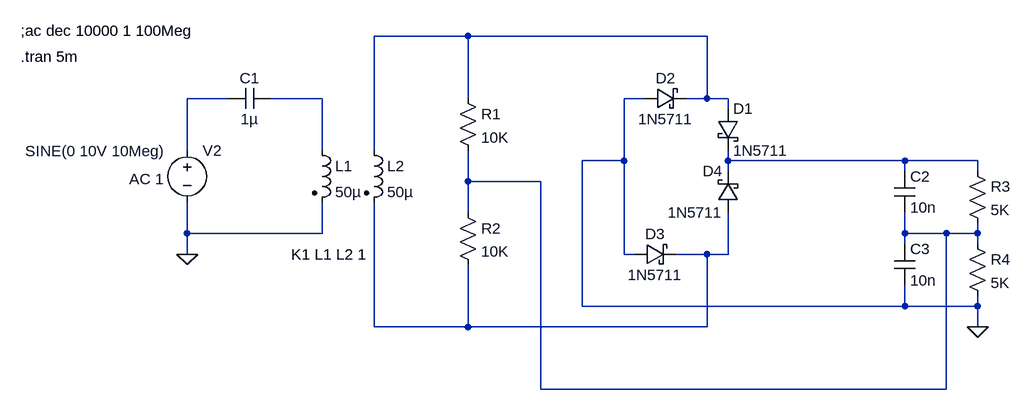
[diagram p0: schematic RF Rectifier Test.asc]
RF Rectifier Test.asc, the LTspice schematic file:
Version 4
SHEET 1 1576 708
WIRE 704 -64 560 -64
WIRE 1072 -64 704 -64
WIRE 336 32 272 32
WIRE 480 32 400 32
WIRE 704 32 704 -64
WIRE 976 32 944 32
WIRE 1072 32 1072 -64
WIRE 1072 32 1040 32
WIRE 1104 32 1072 32
WIRE 1104 48 1104 32
WIRE 272 112 272 32
WIRE 480 112 480 32
WIRE 560 112 560 -64
WIRE 944 128 944 32
WIRE 944 128 880 128
WIRE 1104 128 1104 112
WIRE 1376 128 1104 128
WIRE 1488 128 1376 128
WIRE 1104 144 1104 128
WIRE 1376 144 1376 128
WIRE 1488 144 1488 128
WIRE 704 160 704 112
WIRE 816 160 704 160
WIRE 704 208 704 160
WIRE 272 240 272 192
WIRE 480 240 480 192
WIRE 480 240 272 240
WIRE 1376 240 1376 208
WIRE 1440 240 1376 240
WIRE 1488 240 1488 224
WIRE 1488 240 1440 240
WIRE 1376 256 1376 240
WIRE 1488 256 1488 240
WIRE 272 272 272 240
WIRE 944 272 944 128
WIRE 960 272 944 272
WIRE 1072 272 1024 272
WIRE 1104 272 1104 208
WIRE 1104 272 1072 272
WIRE 880 352 880 128
WIRE 1376 352 1376 320
WIRE 1376 352 880 352
WIRE 1488 352 1488 336
WIRE 1488 352 1376 352
WIRE 560 384 560 192
WIRE 704 384 704 288
WIRE 704 384 560 384
WIRE 1072 384 1072 272
WIRE 1072 384 704 384
WIRE 1488 384 1488 352
WIRE 816 480 816 160
WIRE 1440 480 1440 240
WIRE 1440 480 816 480
FLAG 272 272 0
FLAG 1488 384 0
SYMBOL voltage 272 96 R0
WINDOW 123 -89 60 Left 2
WINDOW 39 0 0 Left 2
WINDOW 3 -249 17 Left 2
SYMATTR Value2 AC 1
SYMATTR InstName V2
SYMATTR Value SINE(0 10V 10Meg)
SYMBOL schottky 976 48 R270
WINDOW 0 32 32 VTop 2
WINDOW 3 0 32 VBottom 2
SYMATTR InstName D2
SYMATTR Value 1N5711
SYMATTR Description Diode
SYMATTR Type diode
SYMBOL cap 1360 144 R0
SYMATTR InstName C2
SYMATTR Value 10n
SYMBOL schottky 1088 48 R0
SYMATTR InstName D1
SYMATTR Value 1N5711
SYMATTR Description Diode
SYMATTR Type diode
SYMBOL schottky 960 288 R270
WINDOW 0 32 32 VTop 2
WINDOW 3 0 32 VBottom 2
SYMATTR InstName D3
SYMATTR Value 1N5711
SYMATTR Description Diode
SYMATTR Type diode
SYMBOL schottky 1120 208 R180
WINDOW 0 24 64 Left 2
WINDOW 3 24 0 Left 2
SYMATTR InstName D4
SYMATTR Value 1N5711
SYMATTR Description Diode
SYMATTR Type diode
SYMBOL ind2 464 96 R0
SYMATTR InstName L1
SYMATTR Value 50µ
SYMATTR Type ind
SYMBOL ind2 544 96 R0
SYMATTR InstName L2
SYMATTR Value 50µ
SYMATTR Type ind
SYMBOL cap 400 16 R90
WINDOW 0 0 32 VBottom 2
WINDOW 3 32 32 VTop 2
SYMATTR InstName C1
SYMATTR Value 1µ
SYMBOL res 688 16 R0
SYMATTR InstName R1
SYMATTR Value 10K
SYMBOL res 688 192 R0
SYMATTR InstName R2
SYMATTR Value 10K
SYMBOL cap 1360 256 R0
SYMATTR InstName C3
SYMATTR Value 10n
SYMBOL res 1472 128 R0
SYMATTR InstName R3
SYMATTR Value 5K
SYMBOL res 1472 240 R0
SYMATTR InstName R4
SYMATTR Value 5K
TEXT 16 -32 Left 2 !.tran 5m
TEXT 16 -72 Left 2 !;ac dec 10000 1 100Meg
TEXT 432 272 Left 2 !K1 L1 L2 1

The netlist it stands for:
* RF Rectifier Test.asc
V2 N002 0 SINE(0 10V 10Meg) AC 1
D2 0 N001 1N5711
C2 N004 N005 10n
D1 N001 N004 1N5711
D3 0 N006 1N5711
D4 N006 N004 1N5711
L1 N003 0 50µ
L2 N001 N006 50µ
C1 N003 N002 1µ
R1 N001 N005 10K
R2 N005 N006 10K
C3 N005 0 10n
R3 N004 N005 5K
R4 N005 0 5K
.model D D
.lib standard.dio
.tran 5m
;ac dec 10000 1 100Meg
K1 L1 L2 1
.backanno
.end